# Altium schematic sheet SCH_Switch.SchDoc
size A4
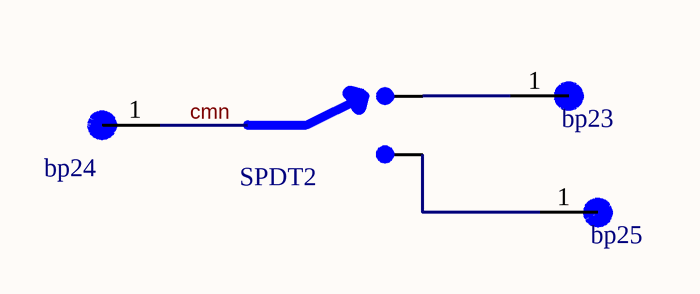
[diagram p0: SCH_Switch.SchDoc]

## Parts
bp23  Board Pad  [Battery pad]  (value not drawn)
bp24  Board Pad  [Battery pad]  (value not drawn)
bp25  Board Pad  [Battery pad]  (value not drawn)
SPDT2  spdt_JS202011SCQN  [SPDT_1]  (value not drawn)

## Nets
cmn: bp24.1 SPDT2.1
Netbp23_1: bp23.1 SPDT2.2
Netbp25_1: bp25.1 SPDT2.3

## Library data of the parts
SPDT2 = spdt_JS202011SCQN: C & K COMPONENTS - JS202011SCQN - SWITCH, DPDT, 0.6A, 6VDC, SMD; Manufacturer: ITT C&K; Actuator Material: Nylon,Polyamide; Max Voltage Rating (DC): 6V; Contact Resistance: 70mR; Max Current Rating: 300mA; Switch Travel: 2mm; Switch Function: On-On; Actuator Type: Standard; Supplier 1: Digi-Key; RoHS: Yes; Category: Slide Switches; Pricing 1: 1=0.55000, 10=0.53000, 25=0.51040, 100=0.44180, 250=0.40252, 500=0.37306 (USD); Mount: Surface Mount; Contact Material: Copper Alloy; Contact Plating: Silver; Housing Material: Nylon; Min Operating Temperature: -20°C; Max Operating Temperature: 85°C; Throw Configuration: DPDT; Termination: Gull Wing; Voltage Rating (DC): 6V; Packaging: Tape and Reel; Contact Current Rating: 300mA; Package Quantity: 1; Current Rating: 300mA; Orientation: Vertical; Length: 9mm; Depth: 7.5mm; Actuator Length: 2mm; Radiation Hardening: No; REACH SVHC: No SVHC; Lead Free: Lead Free; ComponentLink1URL: https://datasheet.ciiva.com/23829/1707718-23829488.pdf?src-supplier=Newark; ComponentLink1Description: https://datasheet.ciiva.com/23829/1707718-23829488.pdf?src-supplier=Newark; ComponentLink2URL: https://datasheet.ciiva.com/2889/js-29aug13-2889127.pdf?src-supplier=Digi-Key; ComponentLink2Description: https://datasheet.ciiva.com/2889/js-29aug13-2889127.pdf?src-supplier=Digi-Key; ComponentLink3URL: https://datasheet.ciiva.com/2889/js-15sept15-2889128.pdf?src-supplier=Digi-Key; ComponentLink3Description: https://datasheet.ciiva.com/2889/js-15sept15-2889128.pdf?src-supplier=Digi-Key; ComponentLink4URL: https://datasheet.ciiva.com/2889/js-15sept15-2889129.pdf?src-supplier=Digi-Key; ComponentLink4Description: https://datasheet.ciiva.com/2889/js-15sept15-2889129.pdf?src-supplier=Digi-Key; ComponentLink5URL: https://datasheet.ciiva.com/22630/1707718-22630697.pdf?src-supplier=Element14; ComponentLink5Description: https://datasheet.ciiva.com/22630/1707718-22630697.pdf?src-supplier=Element14; ComponentLink6URL: https://datasheet.ciiva.com/8625/js-9dec14-8625470.pdf?src-supplier=Avnet; ComponentLink6Description: https://datasheet.ciiva.com/8625/js-9dec14-8625470.pdf?src-supplier=Avnet